# EAGLE design power_monitor (EAGLE 7.6.0)
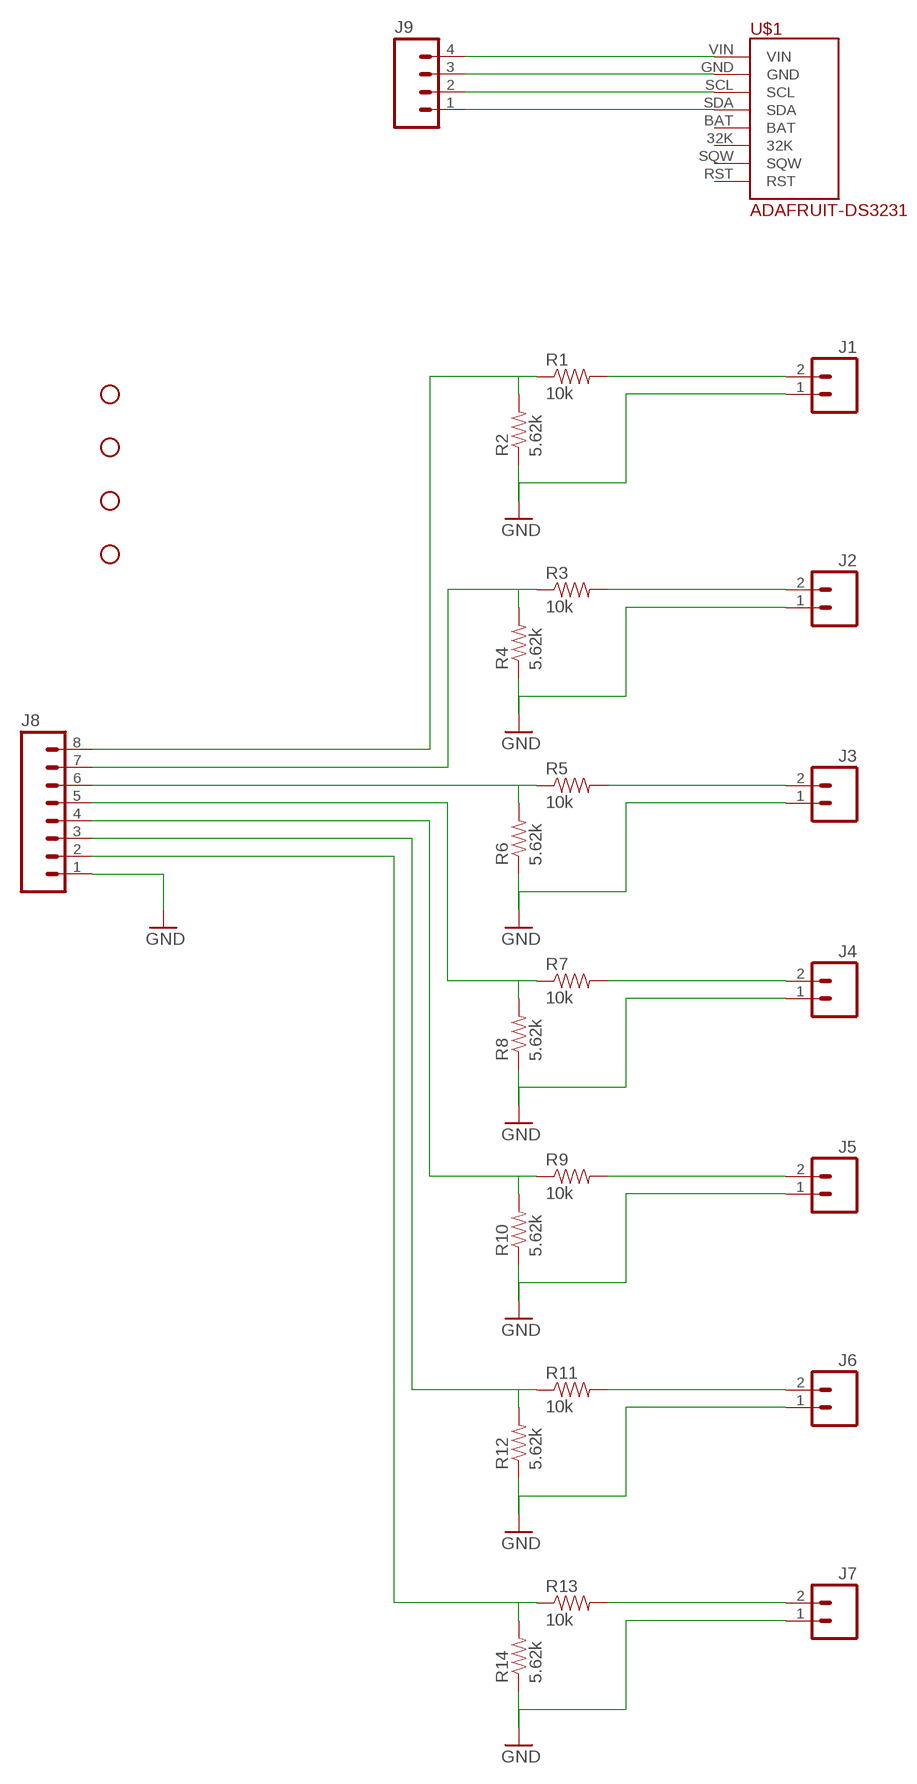
[diagram p0: schematic, sheet 1]

## Parts
H1  STAND-OFF  [STAND-OFF]
H2  STAND-OFF  [STAND-OFF]
H3  STAND-OFF  [STAND-OFF]
H4  STAND-OFF  [STAND-OFF]
J1  M02LOCK_LONGPADS  [1X02_LOCK_LONGPADS]
J2  M02LOCK_LONGPADS  [1X02_LOCK_LONGPADS]
J3  M02LOCK_LONGPADS  [1X02_LOCK_LONGPADS]
J4  M02LOCK_LONGPADS  [1X02_LOCK_LONGPADS]
J5  M02LOCK_LONGPADS  [1X02_LOCK_LONGPADS]
J6  M02LOCK_LONGPADS  [1X02_LOCK_LONGPADS]
J7  M02LOCK_LONGPADS  [1X02_LOCK_LONGPADS]
J8  M08LOCK_LONGPADS  [1X08_LOCK_LONGPADS]
J9  M04LOCK_LONGPADS  [1X04_LOCK_LONGPADS]
R1  10k  RESISTOREZ  [AXIAL-0.3EZ]
R2  5.62k  RESISTOREZ  [AXIAL-0.3EZ]
R3  10k  RESISTOREZ  [AXIAL-0.3EZ]
R4  5.62k  RESISTOREZ  [AXIAL-0.3EZ]
R5  10k  RESISTOREZ  [AXIAL-0.3EZ]
R6  5.62k  RESISTOREZ  [AXIAL-0.3EZ]
R7  10k  RESISTOREZ  [AXIAL-0.3EZ]
R8  5.62k  RESISTOREZ  [AXIAL-0.3EZ]
R9  10k  RESISTOREZ  [AXIAL-0.3EZ]
R10  5.62k  RESISTOREZ  [AXIAL-0.3EZ]
R11  10k  RESISTOREZ  [AXIAL-0.3EZ]
R12  5.62k  RESISTOREZ  [AXIAL-0.3EZ]
R13  10k  RESISTOREZ  [AXIAL-0.3EZ]
R14  5.62k  RESISTOREZ  [AXIAL-0.3EZ]
U$1  ADAFRUIT-DS3231  [ADAFRUIT-DS3231]

## Nets
GND: J1.1 J2.1 J3.1 J4.1 J5.1 J6.1 J7.1 J8.1 R2.P$1 R4.P$1 R6.P$1 R8.P$1 R10.P$1 R12.P$1 R14.P$1
N$1: J2.2 R3.P$2
N$2: J1.2 R1.P$2
N$3: J8.8 R1.P$1 R2.P$2
N$4: J8.7 R3.P$1 R4.P$2
N$5: J3.2 R5.P$2
N$6: J8.6 R5.P$1 R6.P$2
N$7: J4.2 R7.P$2
N$8: J8.5 R7.P$1 R8.P$2
N$9: J5.2 R9.P$2
N$10: J8.4 R9.P$1 R10.P$2
N$11: J6.2 R11.P$2
N$12: J8.3 R11.P$1 R12.P$2
N$13: J7.2 R13.P$2
N$14: J8.2 R13.P$1 R14.P$2
N$15: J9.4 U$1.VIN
N$16: J9.3 U$1.GND
N$17: J9.2 U$1.SCL
N$18: J9.1 U$1.SDA
Unconnected: U$1.32K U$1.BAT U$1.RST U$1.SQW

## Library data of the parts
H1-H4 = SparkFun-Electromechanical:STAND-OFF: #4 Stand Off This is the mechanical footprint for a #4 phillips button head screw. Use the keepout ring to avoid running the screw head into surrounding components. SKU : PRT-00447
J1-J7 = SparkFun-Connectors:M02: Standard 2-pin 0.1" header. Use with - straight break away headers ( PRT-00116) - right angle break away headers (PRT-00553) - swiss pins (PRT-00743) - machine pins (PRT-00117) - female headers (PRT-00115) Molex polarized connector foot print use with: PRT-08233 with associated crimp pins and housings. 2.54_SCREWTERM for use with PRT-10571. 3.5mm Screw Terminal footprints for PRT-08084 5mm Screw Terminal footprints for use with PRT-08432
J8 = SparkFun-Connectors:M08: Header 8 Standard 8-pin 0.1" header. Use with straight break away headers (SKU : PRT-00116), right angle break away headers (PRT-00553), swiss pins (PRT-00743), machine pins (PRT-00117), and female headers (PRT-00115).
J9 = SparkFun-Connectors:M04: Header 4 Standard 4-pin 0.1" header. Use with straight break away headers (SKU : PRT-00116), right angle break away headers (PRT-00553), swiss pins (PRT-00743), machine pins (PRT-00117), and female headers (PRT-00115). Molex polarized connector foot print use with SKU : PRT-08231 with associated crimp pins and housings. 1MM SMD Version SKU: PRT-10208; PROD_ID: CONN-09696
R1-R14 = SparkFun-Passives:RESISTOR: Resistor Basic schematic elements and footprints for 0603, 1206, and PTH resistors.
U$1 = dotson:ADAFRUIT-DS3231

## Board
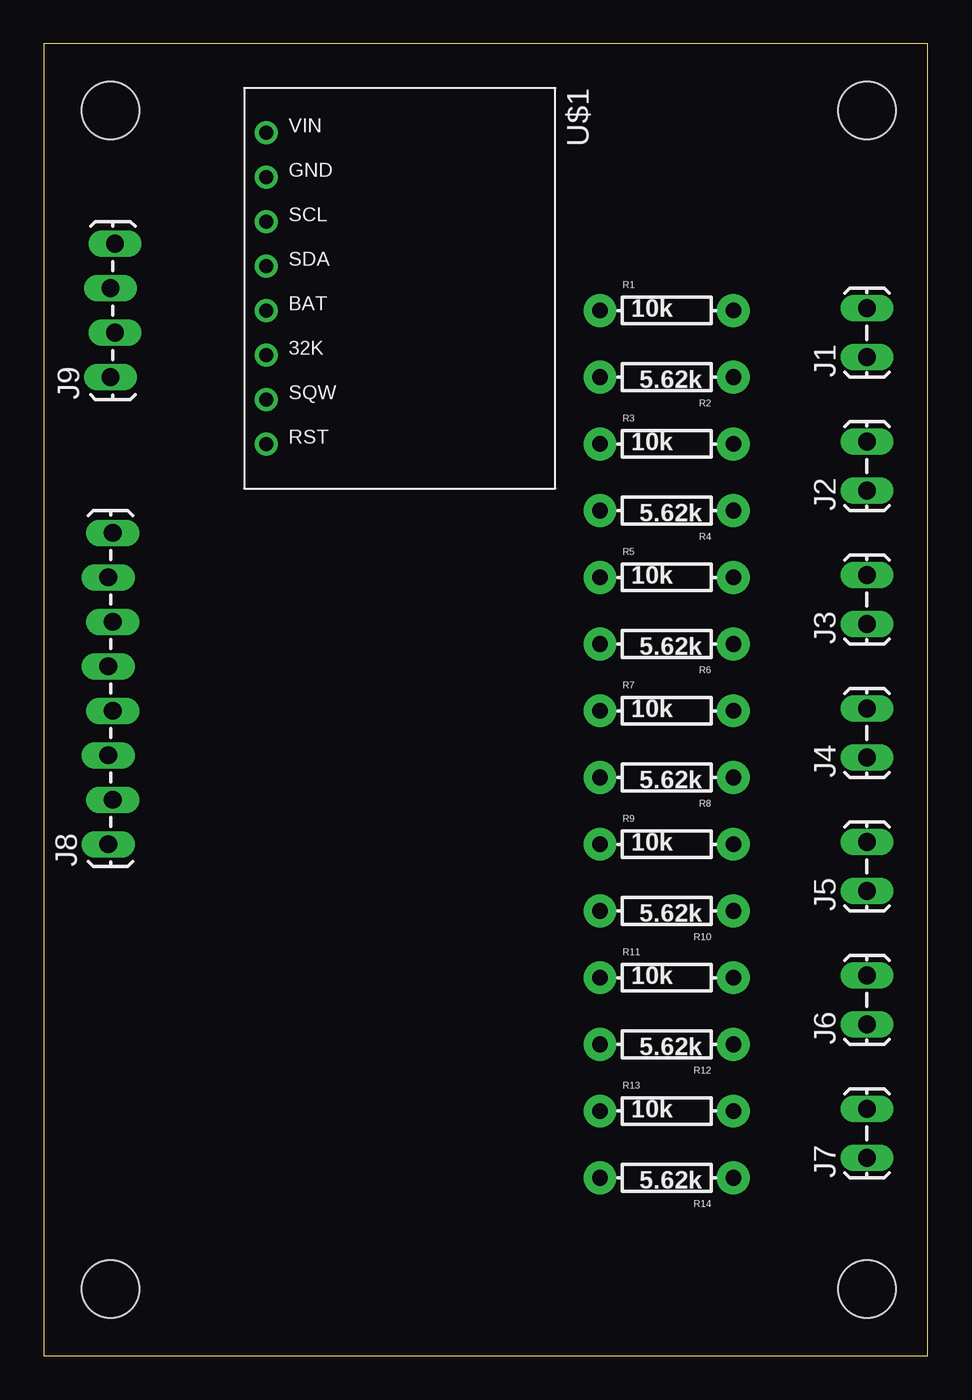
[diagram p1: board, top side]
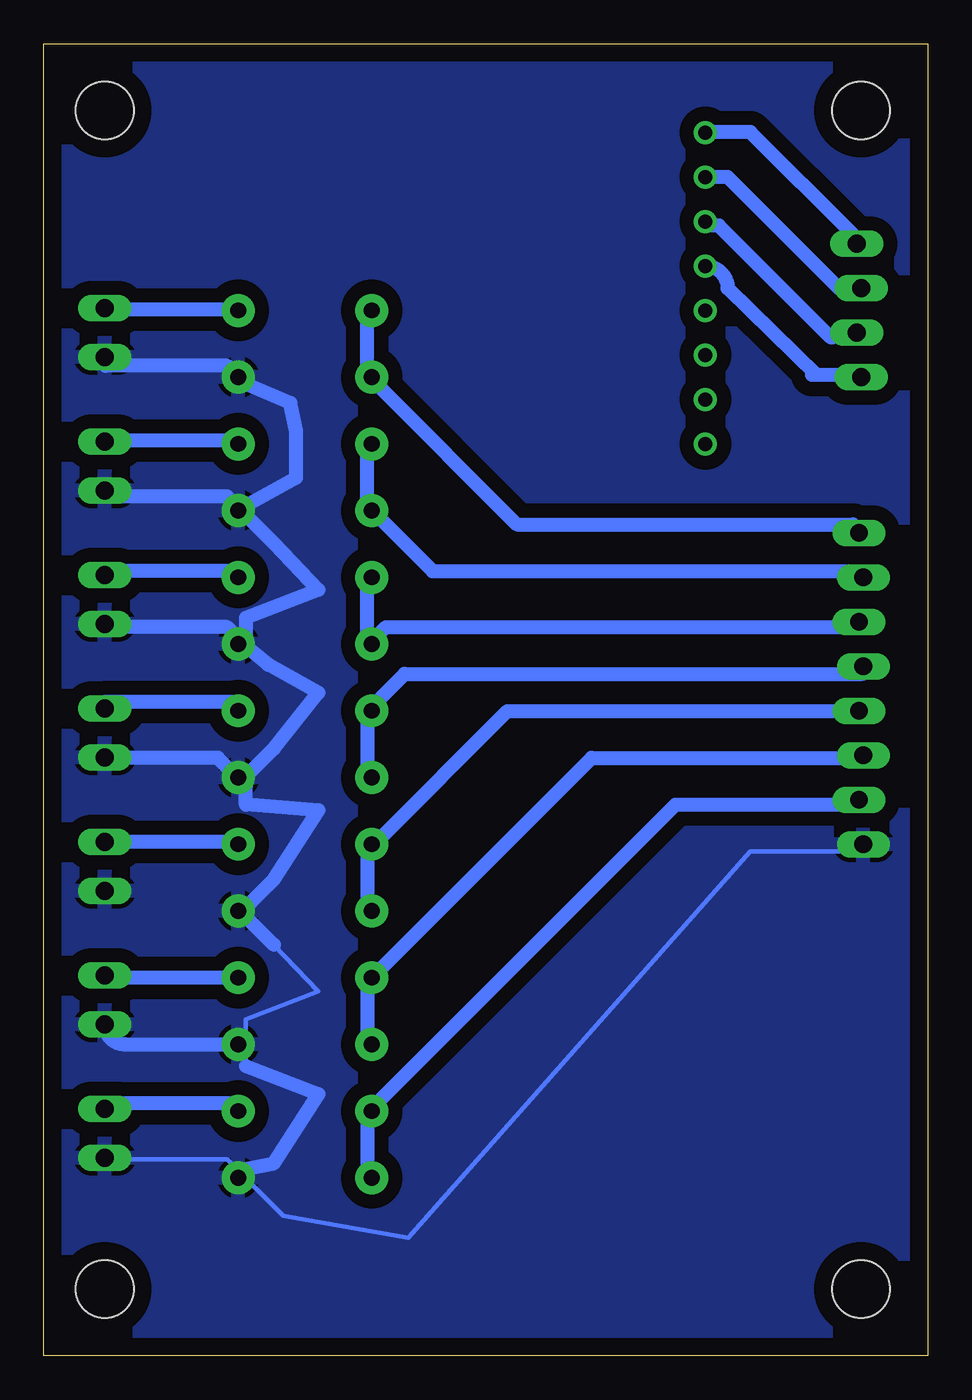
[diagram p2: board, bottom side, seen from below]

Size 50.47 x 74.92 mm. Coordinates in mm from the lower left corner, seen from the top.
Outline: 0,0 50.47,0 50.47,74.92 0,74.92 0,0
Copper layers (1*16): Top 0.035mm / dielectric 1.5mm / Bottom 0.035mm
Design rules "default *": minimum track width 10mil, minimum drill 24mil, track to track 32mil, track to pad 32mil, pad to pad 32mil, via to via 32mil, smd to smd 8mil, copper to edge 40mil, drill to drill 8mil, minimum pad ring 10mil, minimum via ring 8mil, stop-mask expansion 4mil, vias tented up to drill 0mil, thermal gap 10mil

### Footprints (pad centres in the part's own frame; a part is rotated, then mirrored left to right if it is on the bottom)
STAND-OFF = hole 3.302: 0,0
1X02_LOCK_LONGPADS = drill 1.016 long: 1 -0.127,0; 2 2.667,0
1X08_LOCK_LONGPADS = drill 1.016 long: 1 0,0.127; 2 2.54,-0.127; 3 5.08,0.127; 4 7.62,-0.127; 5 10.16,0.127; 6 12.7,-0.127; 7 15.24,0.127; 8 17.78,-0.127
1X04_LOCK_LONGPADS = drill 1.016 long: 1 0,0; 2 2.54,-0.254; 3 5.08,0; 4 7.62,-0.254
AXIAL-0.3EZ = drill 0.9 pad 1.88: P$1 -3.81,0; P$2 3.81,0
ADAFRUIT-DS3231 = drill 0.8: 32K 15.24,1.27; BAT 12.7,1.27; GND 5.08,1.27; RST 20.32,1.27; SCL 7.62,1.27; SDA 10.16,1.27; SQW 17.78,1.27; VIN 2.54,1.27

### Placement (x,y rotation side)
H1  3.81,71.12 0 top
H2  46.99,71.12 0 top
H3  46.99,3.81 0 top
H4  3.81,3.81 0 top
J1  46.99,57.15 90 top
J2  46.99,49.53 90 top
J3  46.99,41.91 90 top
J4  46.99,34.29 90 top
J5  46.99,26.67 90 top
J6  46.99,19.05 90 top
J7  46.99,11.43 90 top
J8  3.81,29.21 90 top
J9  3.81,55.88 90 top
R1  35.56,59.69 0 top
R2  35.56,55.88 180 top
R3  35.56,52.07 0 top
R4  35.56,48.26 180 top
R5  35.56,44.45 0 top
R6  35.56,40.64 180 top
R7  35.56,36.83 0 top
R8  35.56,33.02 180 top
R9  35.56,29.21 0 top
R10  35.56,25.4 180 top
R11  35.56,21.59 0 top
R12  35.56,17.78 180 top
R13  35.56,13.97 0 top
R14  35.56,10.16 180 top
U$1  11.43,72.39 270 top

### Tracks (layer width: path | path; a pad name or v marks a point on that pad's centre or on a via)
GND
  Bottom 0.254: 46.94,56.54 J1.1 | 46.94,41.6 J3.1 | 39.47,41.07 R6.P$1 38.94,41.07 | 46.94,49.07 J2.1 | 39.47,48.54 R4.P$1 38.94,48.54 | 38.94,55.47 R2.P$1 | 46.94,34.14 J4.1 | 39.47,33.07 R8.P$1 | 38.94,18.14 38.94,19.2 34.8,20.8 37.34,23.47 | 38.94,25.07 R10.P$1 | 38.94,32.54 R8.P$1 | J7.1 46.94,11.2 40.01,11.2 39.47,10.67 R14.P$1 | J8.1 3.73,28.8 10.13,28.8 29.67,6.73 36.8,8 38.94,10.13 R14.P$1 | 38.94,16.54 38.94,17.6 R12.P$1 | 38.94,10.67 R14.P$1 | 38.94,33.07 R8.P$1
  Bottom 0.813: 46.94,56.54 40.01,56.54 39.47,56.01 R2.P$1 | 46.94,41.6 40.01,41.6 39.47,41.07 | 46.94,49.07 40.01,49.07 39.47,48.54 | 38.94,41.07 38.94,42.14 34.8,43.74 37.34,46.41 38.94,48.01 R4.P$1 | 38.94,55.47 36.4,54.41 36.07,52.81 36.07,50.14 38.94,48.54 | 46.94,34.14 40.54,34.14 39.47,33.07 | 38.94,25.07 37.34,23.47 | 38.94,18.14 R12.P$1 45.85,17.78 arc90 J6.1 | 38.94,32.54 38.94,31.47 34.8,31.14 37.34,27.2 38.94,25.6 R10.P$1 | 38.94,16.54 34.8,14.94 37.34,11 38.94,10.67 | 38.94,33.07 37.34,34.67 34.8,37.87 37.67,39.47 38.94,40.54 R6.P$1
  pour Bottom: 1.27,74.93 49.53,74.93 49.53,0 1.27,0
N$1
  Bottom 0.254: 39.47,52.27 R3.P$2
  Bottom 0.813: 39.47,52.27 46.94,52.27 J2.2
N$2
  Bottom 0.254: 39.47,59.74 R1.P$2
  Bottom 0.813: 39.47,59.74 46.94,59.74 J1.2
N$3
  Bottom 0.254: 32,56.01 R2.P$2
  Bottom 0.813: J8.8 4.27,47.47 23.47,47.47 31.47,55.47 R2.P$2 | 32,56.01 32,59.21 R1.P$1
N$4
  Bottom 0.254: 31.47,48.01 R4.P$2
  Bottom 0.813: 31.47,48.01 28.27,44.81 3.73,44.81 J8.7 | R3.P$1 32,51.74 32,48.54 R4.P$2
N$5
  Bottom 0.813: J3.2 46.94,44.81 39.47,44.81 R5.P$2
N$6
  Bottom 0.254: 32,41.07 R6.P$2
  Bottom 0.813: J8.6 4.27,41.6 30.94,41.6 31.47,41.07 R6.P$2 | 32,41.07 32,44.27 R5.P$1
N$7
  Bottom 0.254: 46.94,37.34 J4.2
  Bottom 0.813: 46.94,37.34 39.47,37.34 R7.P$2
N$8
  Bottom 0.254: 31.47,37.34 R7.P$1
  Bottom 0.813: 31.47,37.34 29.87,38.94 3.73,38.94 J8.5 | R8.P$2 32,33.07 32,36.8 R7.P$1
N$9
  Bottom 0.254: 39.47,29.34 R9.P$2
  Bottom 0.813: 39.47,29.34 J5.2
N$10
  Bottom 0.254: 31.47,29.34 R9.P$1
  Bottom 0.813: 31.47,29.34 24,36.8 4.27,36.8 J8.4 | R10.P$2 32,25.6 32,28.8 R9.P$1
N$11
  Bottom 0.813: R11.P$2 46.99,21.59 J6.2
N$12
  Bottom 0.254: 3.73,34.14 J8.3 | 32,21.34 R11.P$1
  Bottom 0.813: 3.73,34.14 19.2,34.14 R11.P$1 | 32,21.34 32,18.14 R12.P$2
N$13
  Bottom 0.813: J7.2 46.94,14.4 39.47,14.4 R13.P$2
N$14
  Bottom 0.254: 4.27,31.47 J8.2 | 32,13.87 R13.P$1
  Bottom 0.813: 4.27,31.47 14.4,31.47 31.47,14.4 R13.P$1 | 32,13.87 32,10.67 R14.P$2
N$15
  Bottom 0.813: U$1.VIN 12.27,69.88 10.13,69.88 4.27,64.01 J9.4
N$16
  Bottom 0.813: J9.3 5.08,60.96 11.43,67.31 U$1.GND
N$17
  Bottom 0.813: U$1.SCL 12.27,64.54 11.94,64.54 5.54,58.14 J9.2
N$18
  Bottom 0.813: 6.35,56.01 4.27,56.01 J9.1 | 6.35,56.01 6.6,56.01 | U$1.SDA arc90 11.43,60.96 6.35,56.01